# EAGLE design Enclosure 130x95 BP-R (EAGLE 9.6.2)
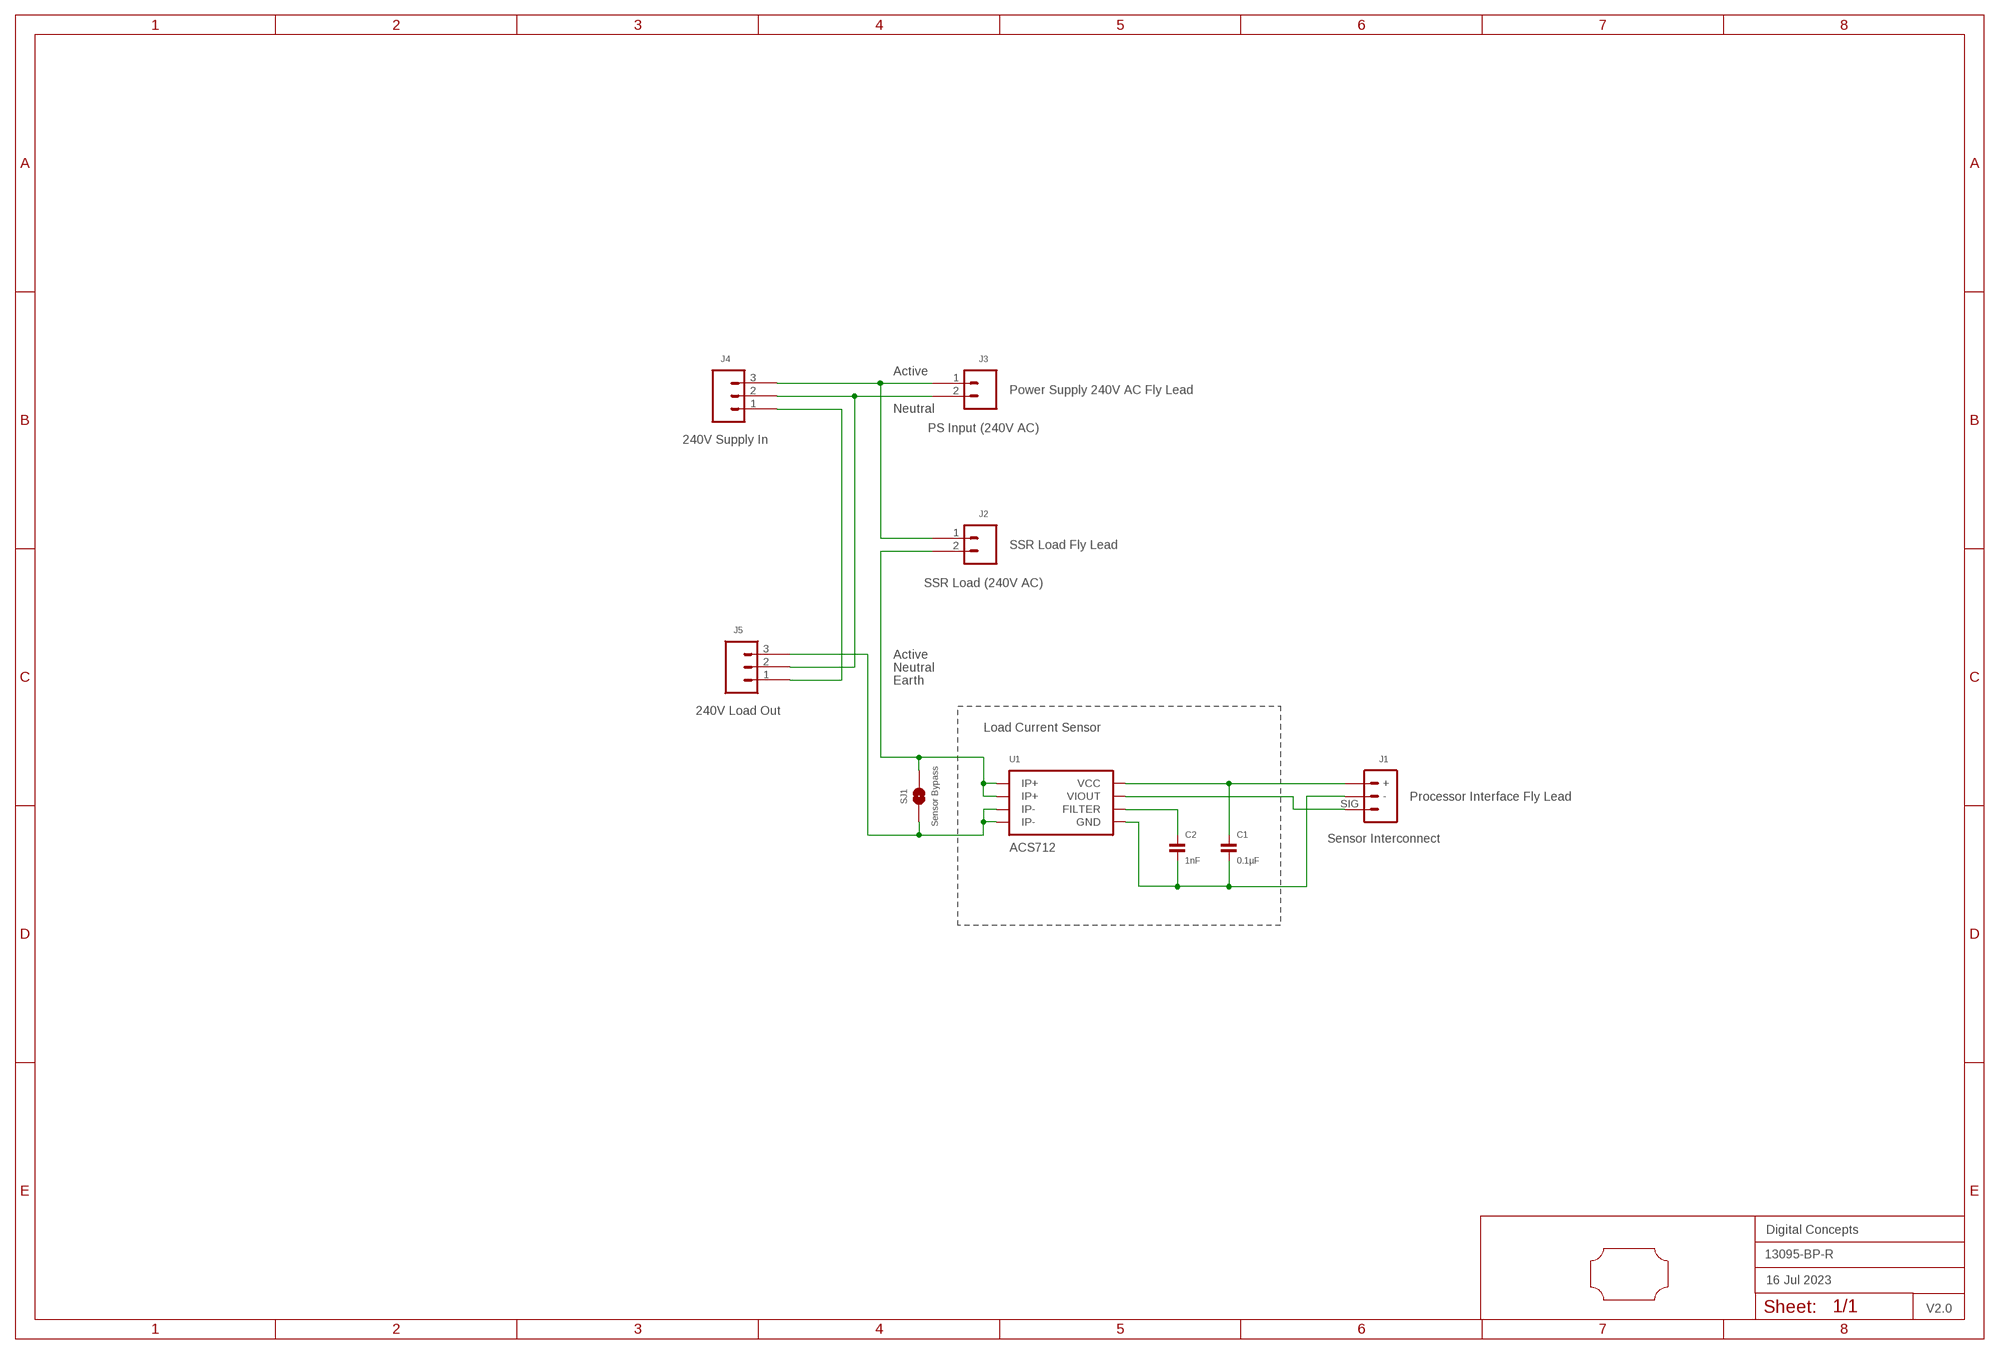
[diagram p0: schematic, sheet 1]
FRAME2 (A3L-LOC): DATE: 16 Jul 2023; OWNER: Digital Concepts; TITLE: 13095-BP-R; VERSION: V2.0

## Parts
C1  0.1µF  CAPACITOR-0805  [C0805]
C2  1nF  CAPACITOR-0805  [C0805]
J1  Sensor Interconnect  JST-PH2.0-3-HORIZONTAL  [JST-PH2.0-3-HORIZONTAL-SIG]
J2  SSR Load (240V AC)  TERMINAL_SCREW_2P_VERTICAL  [TERMINAL-SCREW-2P]
J3  PS Input (240V AC)  JST-XH2.54-2-HORIZONTAL  [JST-XH2.4-2-HORIZONTAL]
J4  240V Supply In  TERMINAL_SCREW_3P_VERTICAL  [TERMINAL-SCREW-3P]
J5  240V Load Out  TERMINAL_SCREW_3P_VERTICAL  [TERMINAL-SCREW-3P]
SJ1  Sensor Bypass  SJ  [SJ]
U1  ACS712  [SOIC-8]
U$1  PCB-OUTLINE-130X95-MAX-RC-H2  [PROTO-130X95-OUTLINE-MAX-RC-H2]

## Nets
ACTIVE_IN: J2.1 J3.1 J4.3
ACTIVE_OUT: J2.2 SJ1.2 U1.P$1(IP+) U1.P$2(IP+)
EARTH: J4.1 J5.1
N$19: J5.3 SJ1.1 U1.P$3(IP-) U1.P$4(IP-)
N$20: C1.2 C2.2 J1.- U1.P$5(GND)
N$22: J1.SIG U1.P$7(VIOUT)
N$23: C1.1 J1.+ U1.P$8(VCC)
N$24: C2.1 U1.P$6(FILTER)
NEUTRAL: J3.2 J4.2 J5.2

## Notes on the sheet
- Active
- Power Supply 240V AC Fly Lead
- Neutral
- SSR Load Fly Lead
- Active
- Neutral
- Earth
- Load Current Sensor
- Processor Interface Fly Lead

## Library data of the parts
C1 C2 = digitalconcepts:CAPACITOR-0805: 0805 Capacitor
J1 = digitalconcepts:JST-PH2.0-3-HORIZONTAL: PH2.0 3P Horizontal Connector
J2 = digitalconcepts:TERMINAL_SCREW_2P_VERTICAL: PCB Mount Screw-Type Terminal 2P
J3 = digitalconcepts:JST-XH2.54-2-HORIZONTAL: XH2.54 2P Horizontal Connector
J4 J5 = digitalconcepts:TERMINAL_SCREW_3P_VERTICAL: PCB Mount Screw-Type Terminal 3P
SJ1 = digitalconcepts:SJ: Solder Jumper
U1 = digitalconcepts:ACS712: ACS712 Hall-Effect-Based Linear Current Sensor IC
U$1 = digitalconcepts:PCB-OUTLINE-130X95-MAX-RC-H2: PCB Eagle Max-Right-Cropped outline for 130 x 95 enclosure (Horizontal format)

## Board
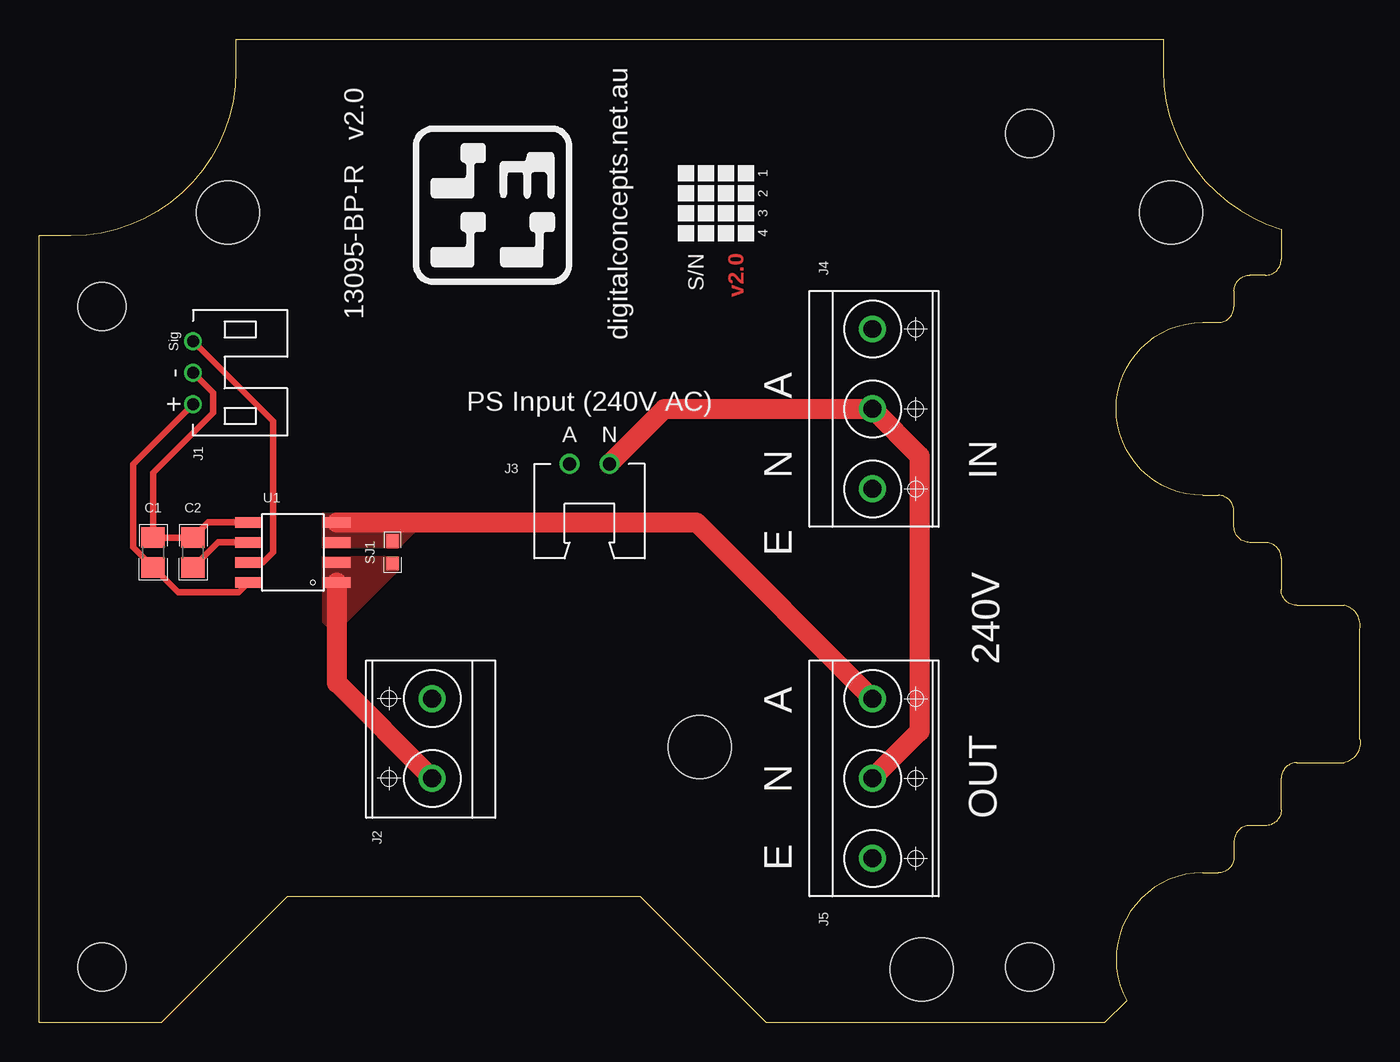
[diagram p1: board, top side]
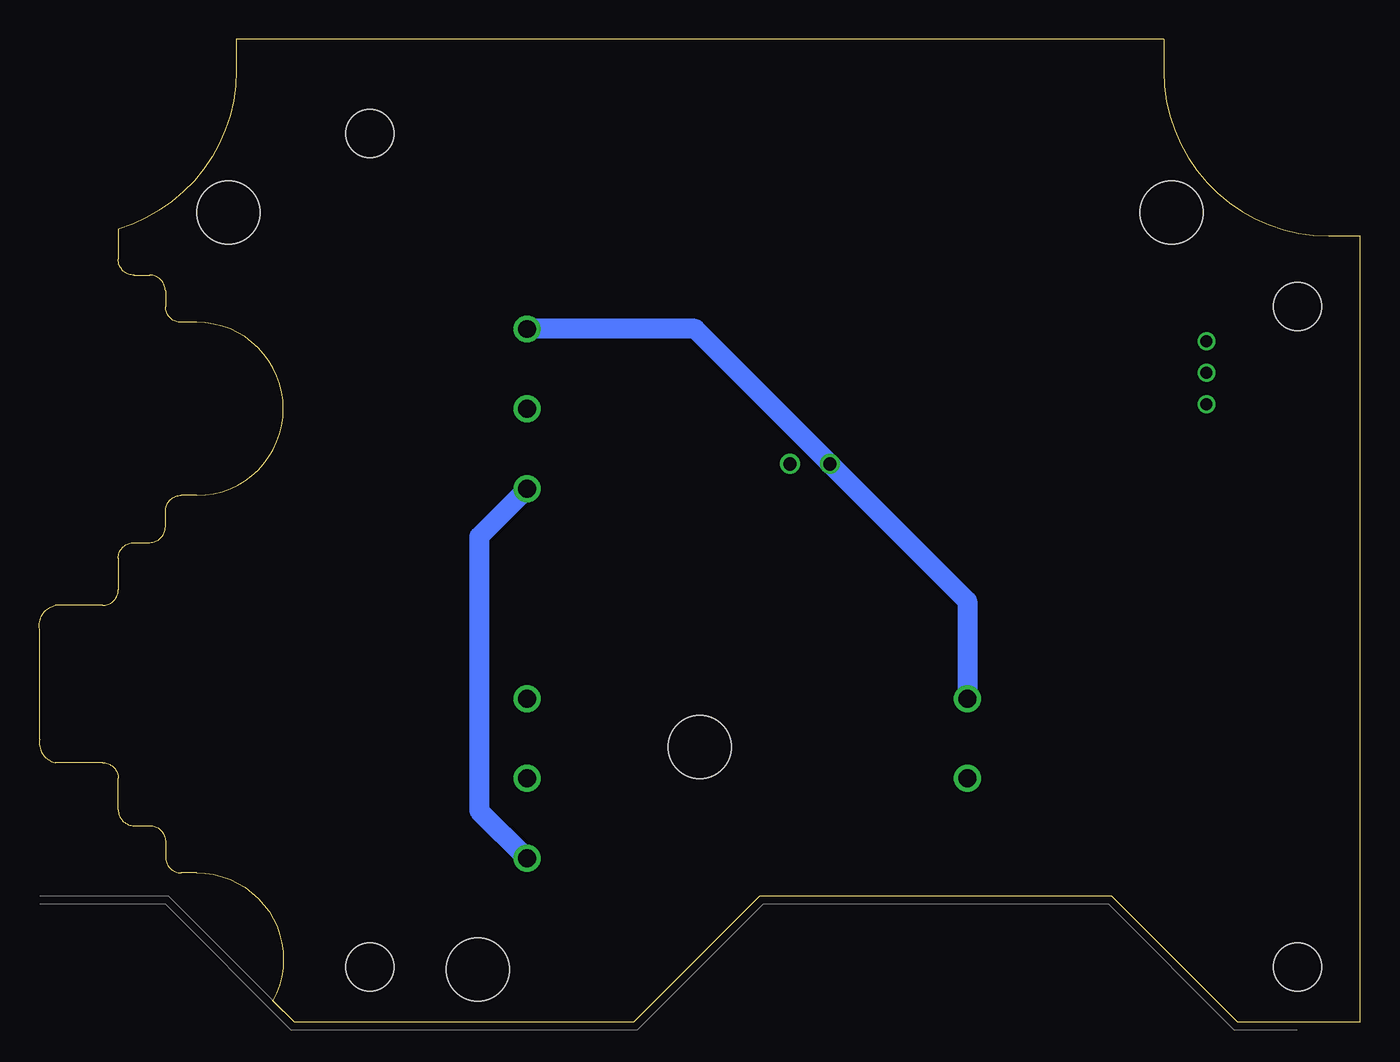
[diagram p2: board, bottom side, seen from below]

Size 84.02 x 62.5 mm. Coordinates in mm from the lower left corner, seen from the top.
Copper layers (1*16): Top 0.035mm / dielectric 1.5mm / Bottom 0.035mm
Design rules "default *": minimum track width 6mil, minimum drill 0.35mm, track to track 6mil, track to pad 6mil, pad to pad 6mil, via to via 6mil, smd to smd 6mil, copper to edge 6mil, drill to drill 6mil, minimum pad ring 1mil, minimum via ring 8mil, stop-mask expansion 4mil, vias tented up to drill 0mil, thermal gap 10mil

### Footprints (pad centres in the part's own frame; a part is rotated, then mirrored left to right if it is on the bottom)
C0805 = smd 1.3 x 1.5: 1 -0.95,0; 2 0.95,0
JST-PH2.0-3-HORIZONTAL-SIG = drill 0.75: + 2,0; - 0,0; SIG -2,0
TERMINAL-SCREW-2P = drill 1.143: 1 -2.58,0; 2 2.5,0
JST-XH2.4-2-HORIZONTAL = drill 0.85: 1 1.27,0; 2 -1.27,0
TERMINAL-SCREW-3P = drill 1.143: 1 -5.08,0; 2 0,0; 3 5.08,0
SJ = smd 0.864 x 0.762: 1 -0.711,0; 2 0.711,0
SOIC-8 = smd 0.65 x 1.75: P$1 -1.905,-2.8; P$2 -0.635,-2.8; P$3 0.635,-2.8; P$4 1.905,-2.8; P$5 1.905,2.8; P$6 0.635,2.8; P$7 -0.635,2.8; P$8 -1.905,2.8
PROTO-130X95-OUTLINE-MAX-RC-H2 = hole 3.048: -38,10; 21,21; 21,-32; -38,-32 | hole 4: 0,-18; -30,16; 30,16; 14.14,-32.14

### Placement (x,y rotation side)
C1  7.24,29.87 90 top
C2  9.78,29.87 90 top
J1  9.78,41.3 270 top
J2  25,18 270 top
J3  35,35.5 180 top
J4  53,39 90 top
J5  53,15.5 90 top
SJ1  22.48,29.87 270 top
U1  16.13,29.87 90 top
U$1  42,35.5 0 top

### Tracks (layer width: path | path; a pad name or v marks a point on that pad's centre or on a via)
ACTIVE_IN
  Bottom 1.27: J4.3 42.31,44.08 J3.1 25,26.77 J2.1
ACTIVE_OUT
  Top 1.27: J2.2 18.93,21.57 U1.P$1
  pour Top (no thermals): 18.04,29.62 22.86,29.62 22.86,28.73 19.18,25.04 18.42,25.04 18.04,25.42
EARTH
  Bottom 1.27: J4.1 56.04,30.88 56.04,13.46 J5.1
N$19
  Top 1.27: J5.3 41.8,31.77 U1.P$4
  pour Top (no thermals): 18.04,32.41 23.75,32.41 24.38,31.77 24.38,31.65 22.86,30.12 18.04,30.12
N$20
  Top 0.406: U1.P$5 10.73,31.77 C2.2 C1.2 7.24,34.95 11.05,38.76 11.05,40.03 J1.-
N$22
  Top 0.406: J1.SIG 14.86,38.22 14.86,29.87 14.23,29.23 U1.P$7
N$23
  Top 0.406: U1.P$8 12.7,27.33 8.83,27.33 C1.1 6.35,29.81 6.34,29.81 5.97,30.19 5.97,35.49 J1.+
N$24
  Top 0.406: C2.1 10.67,29.81 10.68,29.81 11.37,30.51 U1.P$6
NEUTRAL
  Top 1.27: J3.2 39.77,39 J4.2 56,36 56,18.5 J5.2

### Text on the board
Top: v2.0
tPlace: 1 | 13095-BP-R v2.0 | digitalconcepts.net.au | 2 | 3 | 4 | S/N
tNames: A | A | N | N | IN | E | 240V | A | N | OUT | E